# EAGLE design tiny84_temp_humi-v0.1-p4 (EAGLE 5.10)
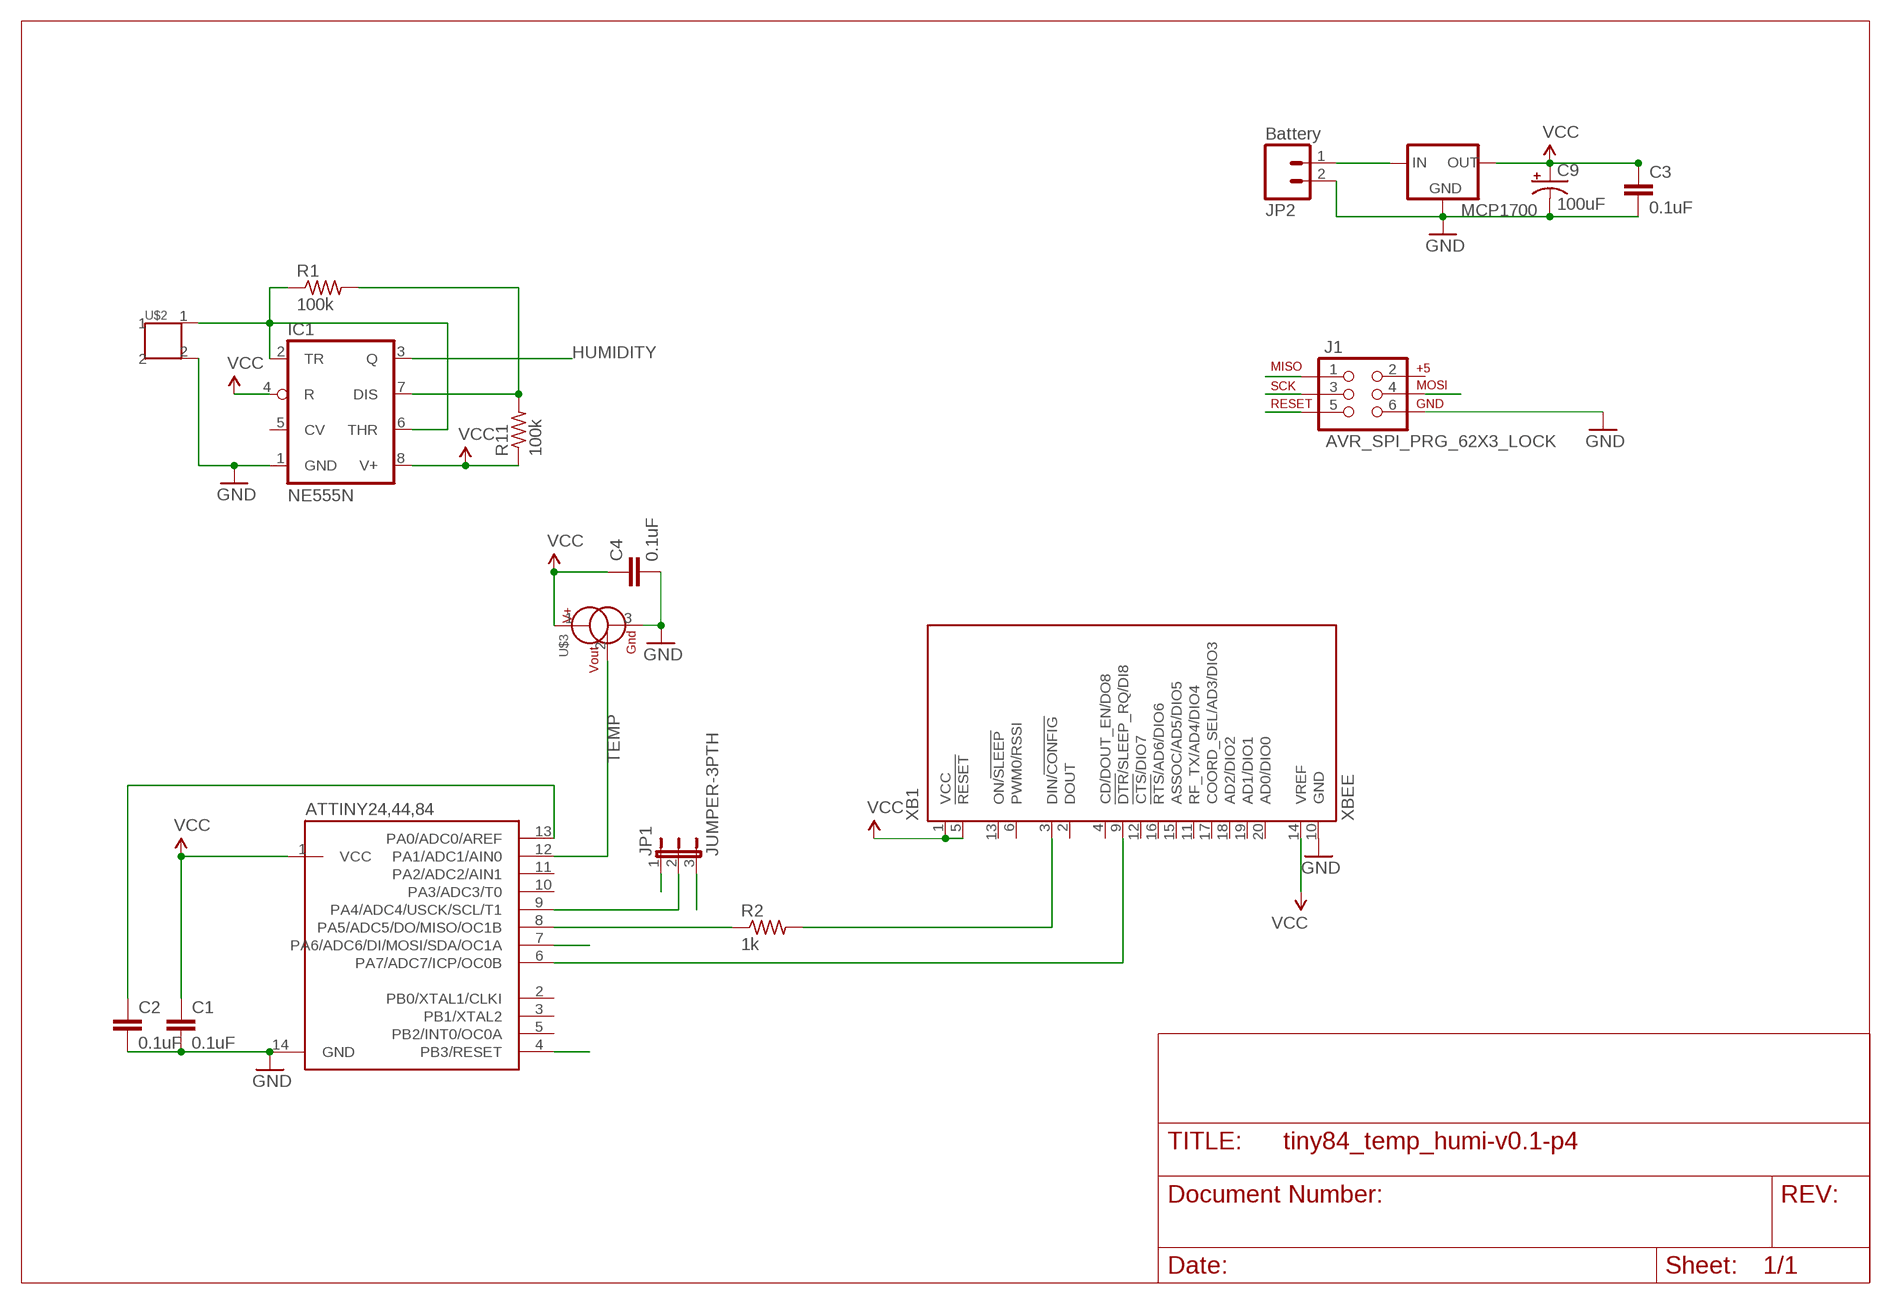
[diagram p0: schematic, sheet 1]

## Parts
ATTINY24,44,84  ATTINY24PDIP  [DIL14]
C1  0.1uF  C-EU050-025X075  [C050-025X075]
C2  0.1uF  C-EU050-035X075  [C050-035X075]
C3  0.1uF  C-EU050-035X075  [C050-035X075]
C4  0.1uF  C-EU050-035X075  [C050-035X075]
C9  100uF  CPOL-USE2-5  [E2-5]
IC1  NE555N  [DIL08-ROUND]
J1  AVR_SPI_PRG_62X3_LOCK  [2X3_LOCK]
JP1  JUMPER-3PTH  [1X03]
JP2  Battery  M025MM  [SCREWTERMINAL-5MM-2]
MCP1700  MCP1700INLINE  [TO92-INLINE]
R1  100k  R-US_0207/10  [0207/10]
R2  1k  R-US_0207/10  [0207/10]
R11  100k  R-US_0207/10  [0207/10]
U$2  HCH1000  [HCH1000-001]
U$3  TMP35,TMP36,TMP37  [TO92-INLINE]
XB1  XBEE  [XBEE]

## Nets
GND: ATTINY24,44,84.14(GND) C1.2 C2.2 C3.2 C4.2 C9.- IC1.1(GND) J1.6 JP2.2 MCP1700.1(GND) U$2.2 U$3.3(GND) XB1.10(GND)
HUMIDITY: IC1.3(Q) JP1.1
MISO: ATTINY24,44,84.8(PA5/ADC5/DO/MISO/OC1B) J1.1 R2.1
MOSI: ATTINY24,44,84.7(PA6/ADC6/DI/MOSI/SDA/OC1A) J1.4
N$1: IC1.2(TR) IC1.6(THR) R1.1 U$2.1
N$4: IC1.7(DIS) R1.2 R11.2
N$5: ATTINY24,44,84.13(PA0/ADC0/AREF) C2.1
N$6: R2.2 XB1.3(DIN/!CONFIG)
N$7: ATTINY24,44,84.6(PA7/ADC7/ICP/OC0B) XB1.9(!DTR!/SLEEP_RQ/DI8)
N$9: JP2.1 MCP1700.2(IN)
RESET: ATTINY24,44,84.4(PB3/RESET) J1.5
SCK: J1.3 JP1.3
SHARED: ATTINY24,44,84.9(PA4/ADC4/USCK/SCL/T1) JP1.2
TEMP: ATTINY24,44,84.12(PA1/ADC1/AIN0) U$3.2(VOUT)
VCC: ATTINY24,44,84.1(VCC) C1.1 C3.1 C4.1 C9.+ IC1.4(R) IC1.8(V+) MCP1700.3(OUT) R11.1 U$3.1(V+) XB1.1(VCC) XB1.5(!RESET) XB1.14(VREF)
Unconnected: ATTINY24,44,84.2(PB0/XTAL1/CLKI) ATTINY24,44,84.3(PB1/XTAL2) ATTINY24,44,84.5(PB2/INT0/OC0A) ATTINY24,44,84.10(PA3/ADC3/T0) ATTINY24,44,84.11(PA2/ADC2/AIN1) IC1.5(CV) J1.2 XB1.2(DOUT) XB1.4(CD/DOUT_EN/DO8) XB1.6(PWM0/RSSI) XB1.11(RF_TX/AD4/DIO4) XB1.12(!CTS!/DIO7) XB1.13(ON/!SLEEP) XB1.15(ASSOC/AD5/DIO5) XB1.16(!RTS!/AD6/DIO6) XB1.17(COORD_SEL/AD3/DIO3) XB1.18(AD2/DIO2) XB1.19(AD1/DIO1) XB1.20(AD0/DIO0)

## Library data of the parts
ATTINY24,44,84 = karlnet-parts:ATTINY24: ATtiny24/44/84. pdip and qfn packages, but the QFN package does _not_ have the bottom pad connected to ground. (doing so would make a 15 pad package, and you couldn't have PDIP and QFN in the same part)
C1-C4 = resistor:C-EU: CAPACITOR, European symbol
C9 = resistor:CPOL-US: POLARIZED CAPACITOR, American symbol
IC1 = adafruit:*555: TIMER Changed DIP package to have round (not oval) pin pads http://www.ladyada.net/library/pcb/eaglelibrary.html
J1 = SparkFun:AVR_SPI_PRG_6: AVR ISP 6 Pin This is the reduced ISP connector for AVR programming. Common on Arduino. This footprint will take up less PCB space and can be used with a 10-pin to 6-pin adapter such as SKU: BOB-08508
JP1 = SparkFun:JUMPER-3
JP2 = SparkFun:M02: Header 2 Standard 2-pin 0.1" header. Use with straight break away headers (SKU : PRT-00116), right angle break away headers (PRT-00553), swiss pins (PRT-00743), machine pins (PRT-00117), and female headers (PRT-00115). Molex polarized connector foot print use with SKU : PRT-08233 with associated crimp pins and housings.
MCP1700 = adafruit:MCP1700: VOLTAGE REGULATOR
R1 R2 R11 = resistor:R-US_: RESISTOR, American symbol
U$2 = karlnet-parts:HCH1000: HCH1000 Capacitive Humidity Sensor Honeywell, cheap, capacitance varies with humidity
U$3 = karlnet-parts:TMP35,TMP36,TMP37: Analog Devices TMP35, TMP36 and TMP37 analog output temperature sensors, TO-92 packaging
XB1 = microbuilder:XBEE: XBee (TM) /XBee-PRO(TM) OEM RF Modules Source: MaxStream, Inc. xbee_productmanual.pdf

## Board
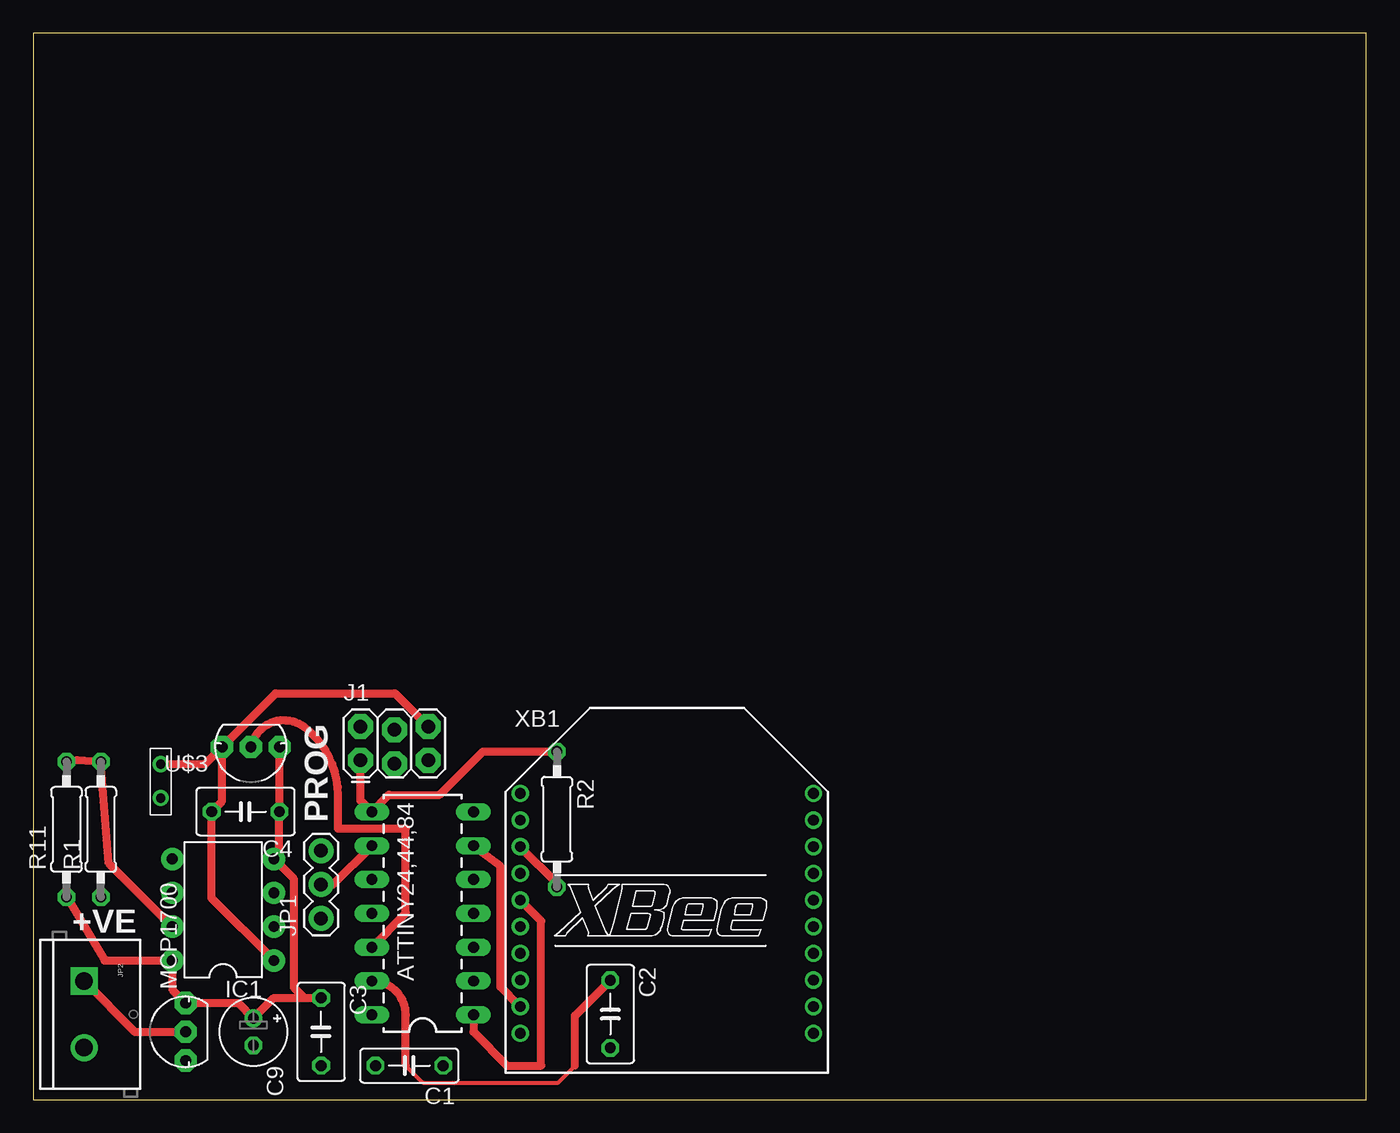
[diagram p1: board, top side]
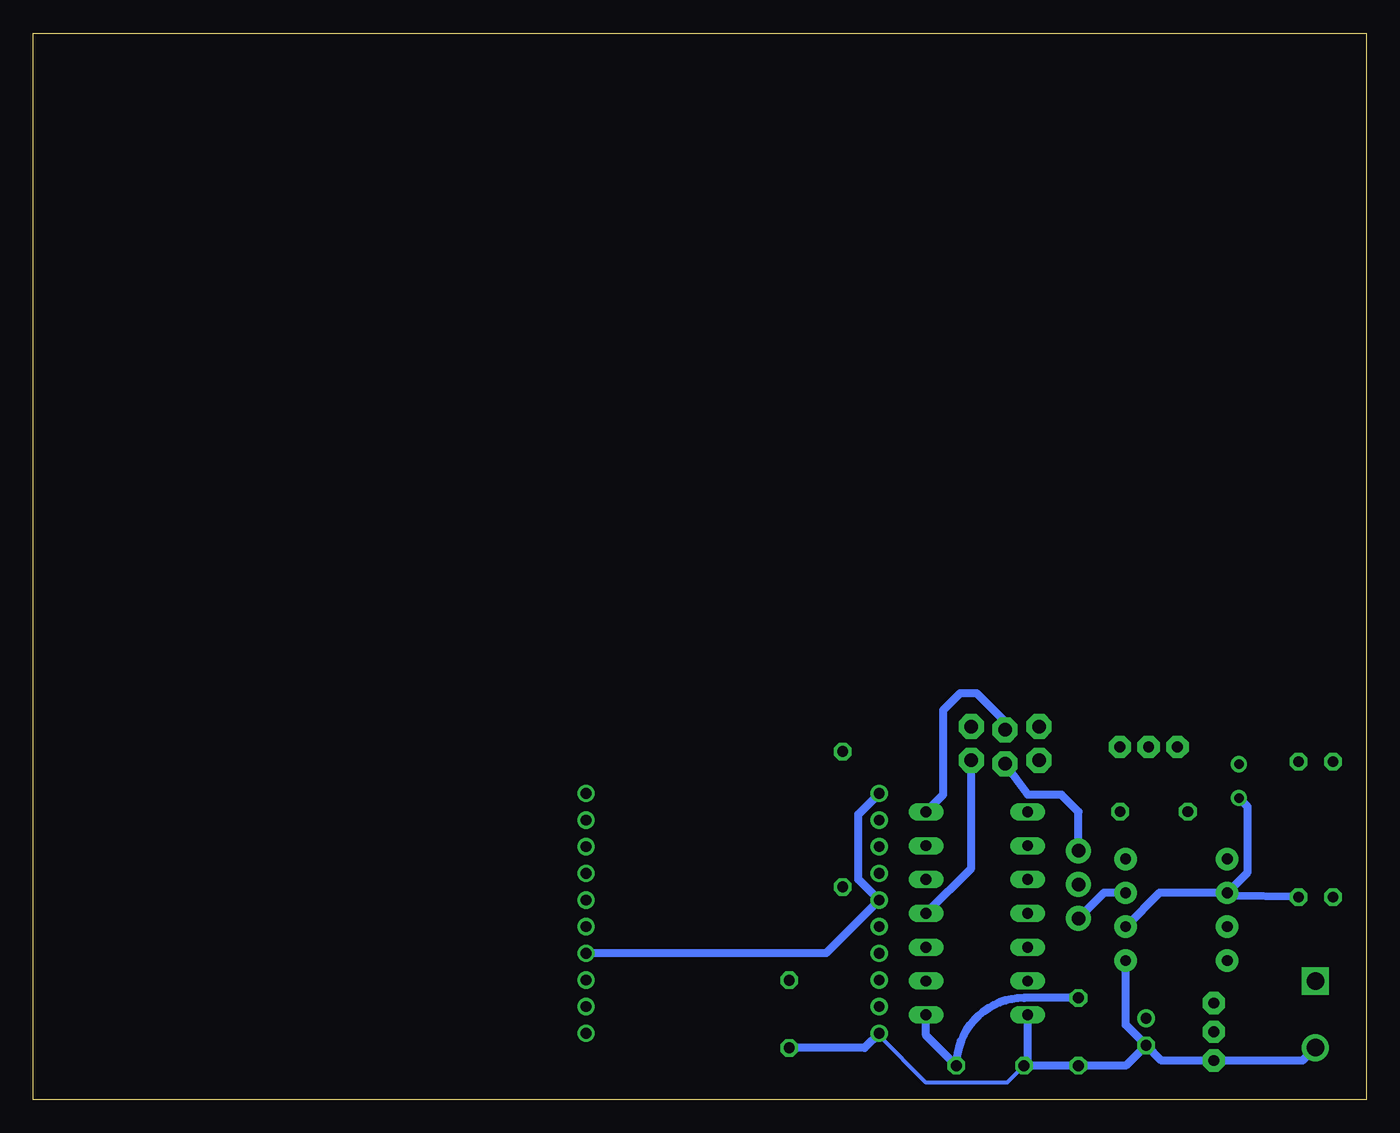
[diagram p2: board, bottom side, seen from below]

Size 100 x 80 mm. Coordinates in mm from the lower left corner, seen from the top.
Outline: 0,0 100,0 100,80 0,80 0,0
Copper layers (1*16): Top 0.035mm / dielectric 1.5mm / Bottom 0.035mm
Design rules "olimex-8mils": minimum track width 8mil, minimum drill 0.6mm, track to track 8mil, track to pad 8mil, pad to pad 8mil, via to via 8mil, smd to smd 8mil, copper to edge 40mil, drill to drill 10mil, minimum pad ring 10mil, minimum via ring 8mil, stop-mask expansion 0mil, vias tented up to drill 0mil, thermal gap 10mil

### Footprints (pad centres in the part's own frame; a part is rotated, then mirrored left to right if it is on the bottom)
DIL14 = drill 0.813 long: 1 -8.89,-3.81; 2 -6.35,-3.81; 3 -3.81,-3.81; 4 -1.27,-3.81; 5 1.27,-3.81; 6 3.81,-3.81; 7 6.35,-3.81; 8 6.35,3.81; 9 3.81,3.81; 10 1.27,3.81; 11 -1.27,3.81; 12 -3.81,3.81; 13 -6.35,3.81; 14 -8.89,3.81
C050-025X075 = drill 0.813 octagon: 1 -2.54,0; 2 2.54,0
C050-035X075 = drill 0.813 octagon: 1 -2.54,0; 2 2.54,0
E2-5 = drill 0.813 pad 1.27 round: + -1.016,0 | drill 0.813 pad 1.27 octagon: - 1.016,0
DIL08-ROUND = drill 0.813 pad 1.676 round: 1 -3.81,-3.81; 2 -1.27,-3.81; 3 1.27,-3.81; 4 3.81,-3.81; 5 3.81,3.81; 6 1.27,3.81; 7 -1.27,3.81; 8 -3.81,3.81
2X3_LOCK = drill 1.016 pad 1.88 octagon: 1 0,0; 2 0,2.54; 3 2.54,-0.254; 4 2.54,2.286; 5 5.08,0; 6 5.08,2.54
1X03 = drill 1.016 pad 1.88 round: 1 0,0; 2 2.54,0; 3 5.08,0
SCREWTERMINAL-5MM-2 = drill 1.3 pad 2.032 square: 1 0,0 | drill 1.3 pad 2.032 round: 2 5,0
TO92-INLINE = drill 0.813 pad 1.676 octagon: 1 -2.159,0; 2 0,0; 3 2.159,0
0207/10 = drill 0.813 octagon: 1 -5.08,0; 2 5.08,0
HCH1000-001 = drill 0.7 round: 1 -2.54,0; 2 0,0
XBEE = drill 0.8 pad 1.27 round: 1 -11,9; 2 -11,7; 3 -11,5; 4 -11,3; 5 -11,1; 6 -11,-1; 7 -11,-3; 8 -11,-5; 9 -11,-7; 10 -11,-9; 11 11,-9; 12 11,-7; 13 11,-5; 14 11,-3; 15 11,-1; 16 11,1; 17 11,3; 18 11,5; 19 11,7; 20 11,9

### Placement (x,y rotation side)
ATTINY24,44,84  29.21,15.24 90 top
C1  28.21,2.54 180 top
C2  43.29,6.41 270 top
C3  21.59,5.08 270 top
C4  15.92,21.6 180 top
C9  16.51,5.08 270 top
IC1  14.24,14.24 90 top
J1  24.55,25.45 0 top
JP1  21.59,13.59 90 top
JP2  3.81,8.89 270 top
MCP1700  11.43,5.08 90 top
R1  5.07,20.27 90 top
R2  39.28,21.03 270 top
R11  2.49,20.27 90 top
U$2  9.55,25.16 90 top
U$3  16.32,26.46 180 top
XB1  47.53,13.97 0 top

### Tracks (layer width: path | path; a pad name or v marks a point on that pad's centre or on a via)
GND
  Top 0.61: IC1.1 13.38,15.1 C4.2 14.16,22.38 U$3.3 | U$3.3 12.86,25.16 U$2.2 | U$3.3 18.18,30.48 27.14,30.48 J1.6
  Bottom 0.254: U$3.3 13.97,26.67
  Bottom 0.305: C1.2 26.94,1.27 33.02,1.27 36.53,4.78
  Bottom 0.61: JP2.2 4.78,2.92 MCP1700.1 15.37,2.92 C9.- | C9.- 18.03,2.54 C3.2 C1.2 25.4,2.81 ATTINY24,44,84.14 | 36.53,4.78 XB1.10 37.63,3.87 C2.2 | C9.- 18.05,5.6 IC1.1
HUMIDITY
  Bottom 0.61: IC1.3 19.67,15.51 JP1.1
MISO
  Top 0.61: J1.1 24.55,22.44 ATTINY24,44,84.8 26.67,22.86 30.48,22.86 33.73,26.11 R2.1
MOSI
  Bottom 0.61: ATTINY24,44,84.7 31.75,22.86 31.75,29.21 30.48,30.48 29.21,30.48 27.09,28.36 J1.4
N$1
  Bottom 0.61: IC1.2 15.51,15.51 IC1.6 | IC1.6 10.21,15.29 R1.1 | IC1.6 8.89,17.05 8.89,21.96 U$2.1
N$4
  Top 0.61: IC1.7 5.67,17.73 R1.2 3.29,25.45 R11.2
N$5
  Top 0.305: 27.94,2.54 29.21,1.27 39.37,1.27 40.64,2.54
  Top 0.61: ATTINY24,44,84.13 arc-90 27.94,6.35 27.94,2.54 | 40.64,2.54 40.64,6.3 C2.1
N$6
  Top 0.61: XB1.3 39.28,16.22 R2.2
N$7
  Top 0.61: ATTINY24,44,84.6 35.05,17.53 35.05,8.45 XB1.9
N$9
  Top 0.61: JP2.1 7.62,5.08 MCP1700.2
RESET
  Bottom 0.61: ATTINY24,44,84.4 29.63,17.36 J1.5
SCK
  Bottom 0.61: J1.3 25.4,22.86 22.86,22.86 21.59,21.59 JP1.3
SHARED
  Top 0.61: JP1.2 22.48,16.13 ATTINY24,44,84.9
TEMP
  Top 0.61: ATTINY24,44,84.12 27.94,13.97 27.94,20.32 22.86,20.32 22.86,22.86 arc53 20.32,27.94 arc114 U$3.2
VCC
  Top 0.61: U$3.1 18.48,21.62 C4.1 18.46,18.46 IC1.4 19.56,16.54 19.56,8.38 20.32,7.62 | R11.1 5.35,10.43 IC1.8 10.43,8.24 MCP1700.3 15.37,7.24 C9.+ 18.03,7.62 20.32,7.62 | ATTINY24,44,84.1 33.02,5.08 35.56,2.54 38.1,2.54 38.1,13.4 XB1.5 | 20.32,7.62 C3.1
  Bottom 0.61: XB1.14 40.53,10.97 XB1.5 36.56,14.97 38.1,16.51 38.1,21.4 XB1.1 | ATTINY24,44,84.1 33.02,4.81 C1.1 arc90 25.67,7.62 C3.1

### Text on the board
tPlace: PROG | +VE